# Altium project vib_analysis_hub.PrjPcb
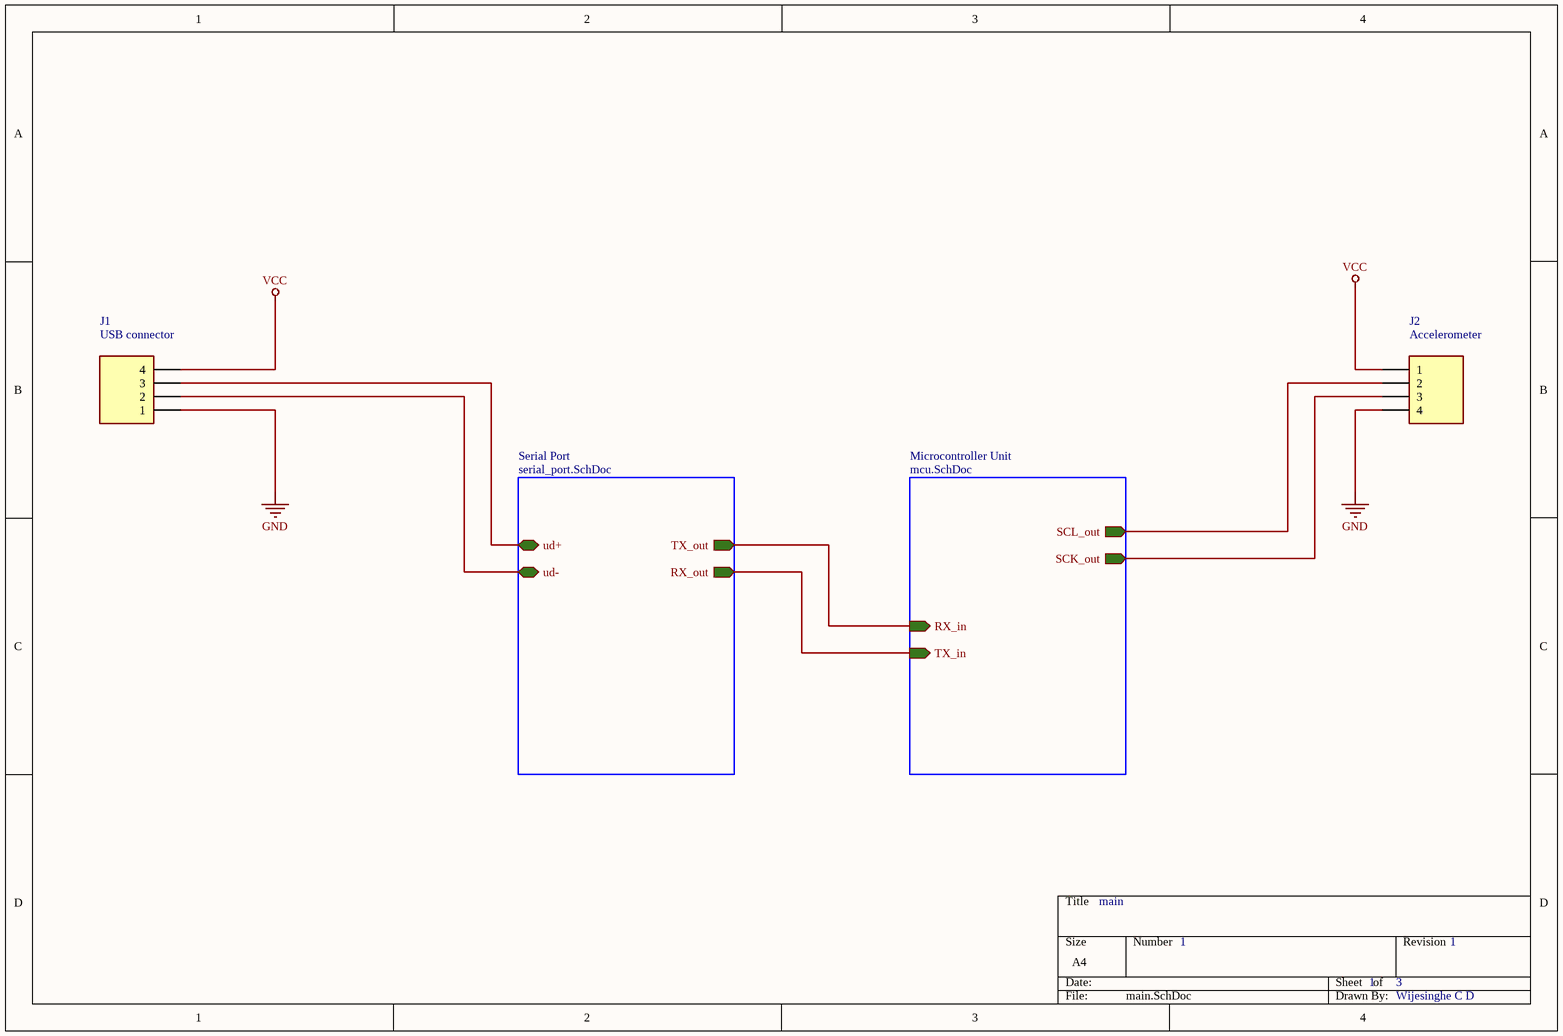
[diagram p0: main.SchDoc]
3 sheets, 16 parts. Net scope: hierarchical (ports join the sheet entries above them; power ports are global).
Board file: pcb_main.PcbDoc
Sheets:
  main.SchDoc
    Microcontroller Unit = mcu.SchDoc
    Serial Port = serial_port.SchDoc

## Sheet main.SchDoc
size A4; SheetNumber: 1; SheetTotal: 3

### Parts
J1  USB connector  [B04BPSILEA1LFSN]
J2  Accelerometer  [B04BPSILEA1LFSN]

### Sub-sheets
Microcontroller Unit = mcu.SchDoc: RX_in (in), TX_in (in), SCL_out (out), SCK_out (out)
Serial Port = serial_port.SchDoc: RX_out (out), TX_out (out), ud+ (bidir), ud- (bidir)

### Nets
GND: J1.1 J2.4
VCC: J1.4 J2.1
NetJ1_2: J1.2 ; sheet Serial Port/ud-
NetJ1_3: J1.3 ; sheet Serial Port/ud+
NetJ2_2: J2.2 ; sheet Microcontroller Unit/SCL_out
NetJ2_3: J2.3 ; sheet Microcontroller Unit/SCK_out
NetU1_30: sheet Microcontroller Unit/RX_in, sheet Serial Port/TX_out
NetU1_31: sheet Microcontroller Unit/TX_in, sheet Serial Port/RX_out

### Notes on the sheet
- main
- 1
- 3
- Wijesinghe C D

### Library data of the parts
J1 J2 = B04B-PSILE-A1_LF__SN_: Connector; Manufacturer_Name: JST (JAPAN SOLDERLESS TERMINALS); Manufacturer_Part_Number: B04B-PSILE-A1(LF)(SN); Datasheet Link: http://uk.rs-online.com/web/p/products/1383547; Height: 12.35mm

## Sheet mcu.SchDoc
size A4; ApprovedBy: wijesinghecd; DrawnBy: wijesinghecd; SheetNumber: 2; SheetTotal: 3
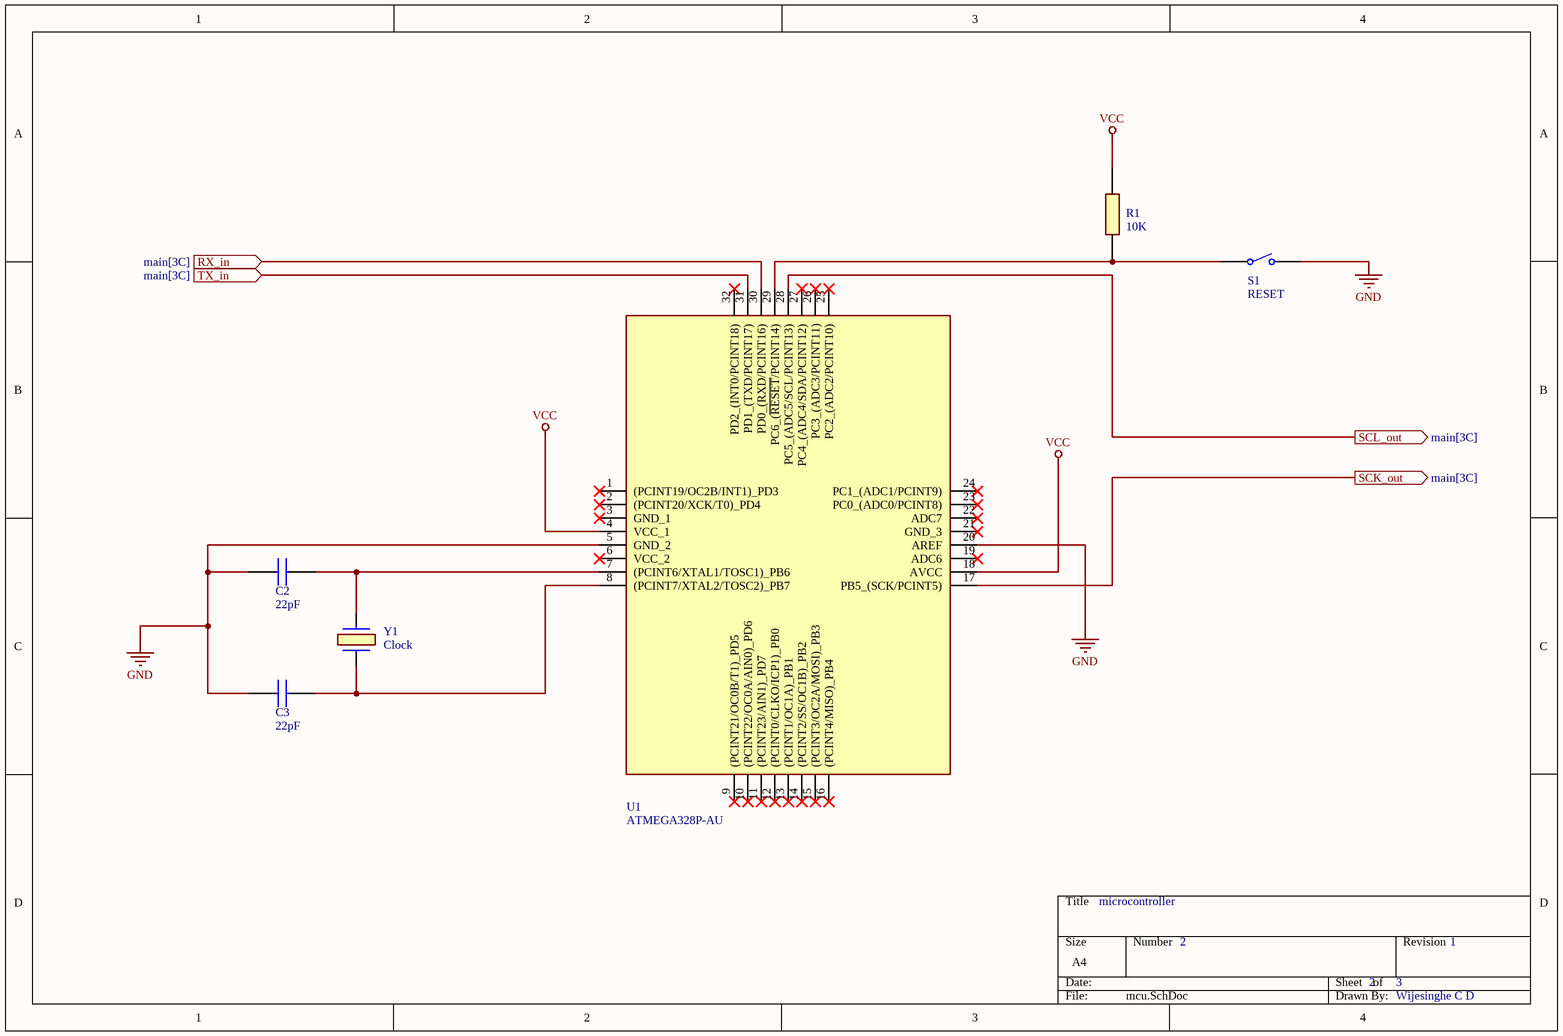
[diagram p1: mcu.SchDoc]

### Parts
C2  22pF  [CAPC3216X100N]
C3  22pF  [CAPC3216X100N]
R1  10K  [RESC2012X75N]
S1  RESET  [TECO-FSMSM-2_V]
U1  ATMEGA328P-AU  [QFP80P900X900X120-32N]
Y1  Clock  [ECS160203XTR]

### Ports
RX_in (in, see main[3C]), SCK_out (out, see main[3C]), SCL_out (out, see main[3C]), TX_in (in, see main[3C])

### Nets
GND: C2.1 C3.1 S1.2 U1.5(GND_2) U1.20(AREF)
VCC: R1.2 U1.4(VCC_1) U1.18(AVCC)
NetC2_2: C2.2 U1.7((PCINT6/XTAL1/TOSC1)_PB6) Y1.1(X1)
NetC3_2: C3.2 U1.8((PCINT7/XTAL2/TOSC2)_PB7) Y1.2(X2)
NetJ2_2: U1.28(PC5_(ADC5/SCL/PCINT13)) ; port SCL_out
NetJ2_3: U1.17(PB5_(SCK/PCINT5)) ; port SCK_out
NetR1_1: R1.1 S1.1 U1.29(PC6_(~{RESET}/PCINT14))
NetU1_30: U1.30(PD0_(RXD/PCINT16)) ; port RX_in
NetU1_31: U1.31(PD1_(TXD/PCINT17)) ; port TX_in

Not connected (* = marked no-connect by the designer): U1 1((PCINT19/OC2B/INT1)_PD3)* 2((PCINT20/XCK/T0)_PD4)* 3(GND_1)* 6(VCC_2)* 9((PCINT21/OC0B/T1)_PD5)* 10((PCINT22/OC0A/AIN0)_PD6)* 11((PCINT23/AIN1)_PD7)* 12((PCINT0/CLKO/ICP1)_PB0)* 13((PCINT1/OC1A)_PB1)* 14((PCINT2/SS/OC1B)_PB2)* 15((PCINT3/OC2A/MOSI)_PB3)* 16((PCINT4/MISO)_PB4)* 19(ADC6)* 21(GND_3)* 22(ADC7)* 23(PC0_(ADC0/PCINT8))* 24(PC1_(ADC1/PCINT9))* 25(PC2_(ADC2/PCINT10))* 26(PC3_(ADC3/PCINT11))* 27(PC4_(ADC4/SDA/PCINT12))* 32(PD2_(INT0/PCINT18))*

### Notes on the sheet
- microcontroller
- 2
- 3
- 1
- Wijesinghe C D

### Library data of the parts
C2 C3 = CL31C220JBCNNNC: Capacitor; Manufacturer_Name: SAMSUNG; Datasheet Link: http://product.samsungsem.com/mlcc/CL31C220JBCNNN.do; Height: 1mm; Manufacturer_Part_Number: CL31C220JBCNNNC; Mouser Part Number: 187-CL31C220JBCNNNC; Mouser Price/Stock: https://www.mouser.co.uk/ProductDetail/Samsung-Electro-Mechanics/CL31C220JBCNNNC?qs=349EhDEZ59op%2FLhphPFLcA%3D%3D; Arrow Part Number: CL31C220JBCNNNC; Arrow Price/Stock: https://www.arrow.com/en/products/cl31c220jbcnnnc/samsung-electro-mechanics?region=nac
R1 = ERJ-P6WF1002V: Resistor; Manufacturer_Name: Panasonic; Datasheet Link: https://datasheet.datasheetarchive.com/originals/distributors/DKDS-25/487413.pdf; Height: 0.75mm; Manufacturer_Part_Number: ERJ-P6WF1002V; Mouser Part Number: 667-ERJ-P6WF1002V; Mouser Price/Stock: https://www.mouser.co.uk/ProductDetail/Panasonic/ERJ-P6WF1002V?qs=%252B9%2Fcbd0IE0SZfBV6iDIV5A%3D%3D; Arrow Part Number: ERJ-P6WF1002V; Arrow Price/Stock: https://www.arrow.com/en/products/erj-p6wf1002v/panasonic?region=nac
S1 = CMP-2000-07511-1: FSMSM Push Button Switch, 50 mA, -35 to 85 degC, 2-Pin SMD, RoHS, Bulk; Manufacturer: TE Connectivity; Actuator Length: 1.07mm; Electrical Life: 20000Cycles; Actuator Material: Polyamide; Current Rating: 50mA; Illumination Type: Illuminated; Voltage Rating (DC): 24V; Contact Resistance: 100mOhm; Case\/Package: SMD/SMT; Operating Force: 180gf; Switch Travel: 0.25mm; Max Voltage Rating (DC): 12V; Throw Configuration: SPST; Packaging: LoosePiece; Max Operating Temperature: 85degC; ELV: Compliant; Package Description: 2-Pin Surface Mount Device, Body 6 x 3.5 mm, Pitch 9.19 mm; RoHSCompliant: true; Manufacturer URL: http://www.te.com/; Contact Plating: Silver; Contact Material: Brass; Mounting Technology: SurfaceMount; Contact Current Rating: 50mA; Datasheet Version: Rev. C2, 08/2014; Datasheet URL: http://www.te.com/commerce/DocumentDelivery/DDEController?Action=showdoc&DocId=Customer+Drawing%7F1437566-3%7FC2%7Fpdf%7FEnglish%7FENG_CD_1437566-3_C2_1437566_3_1_c.dwg.pdf%7F1437566-3; Mechanical Life: 20000Cycles; Package Reference: FSMSM; REACH SVHC: Unknown; Orientation: Straight; Min Operating Temperature: -35degC; Lead Free: LeadFree; Termination: GullWing; Package Quantity: 1000; Mount: SurfaceMount
U1 = ATMEGA328P-AU: Integrated Circuit; Manufacturer_Name: Microchip; Datasheet Link: https://componentsearchengine.com/Datasheets/2/ATMEGA328P-AU.pdf; Height: 1.2mm; Manufacturer_Part_Number: ATMEGA328P-AU; Mouser Part Number: 556-ATMEGA328P-AU; Mouser Price/Stock: https://www.mouser.co.uk/ProductDetail/Microchip-Technology/ATMEGA328P-AU?qs=K8BHR703ZXiCmmgp6%2FGNmQ%3D%3D; Arrow Part Number: ATMEGA328P-AU; Arrow Price/Stock: https://www.arrow.com/en/products/atmega328p-au/microchip-technology?region=europe
Y1 = ECS-160-20-3X-TR: Crystal or Oscillator; Manufacturer_Name: ECS; Datasheet Link: https://www.arrow.com/en/products/ecs-160-20-3x-tr/ecs-international; Height: 2.3mm; Manufacturer_Part_Number: ECS-160-20-3X-TR; Mouser Part Number: 520-160-20-3XT; Mouser Price/Stock: https://www.mouser.co.uk/ProductDetail/ECS/ECS-160-20-3X-TR?qs=7Z%2FjUg96RbU1ElbRFXn8Rw%3D%3D; Arrow Part Number: ECS-160-20-3X-TR; Arrow Price/Stock: https://www.arrow.com/en/products/ecs-160-20-3x-tr/ecs-international?region=nac

## Sheet serial_port.SchDoc
size A4; SheetNumber: 3; SheetTotal: 3
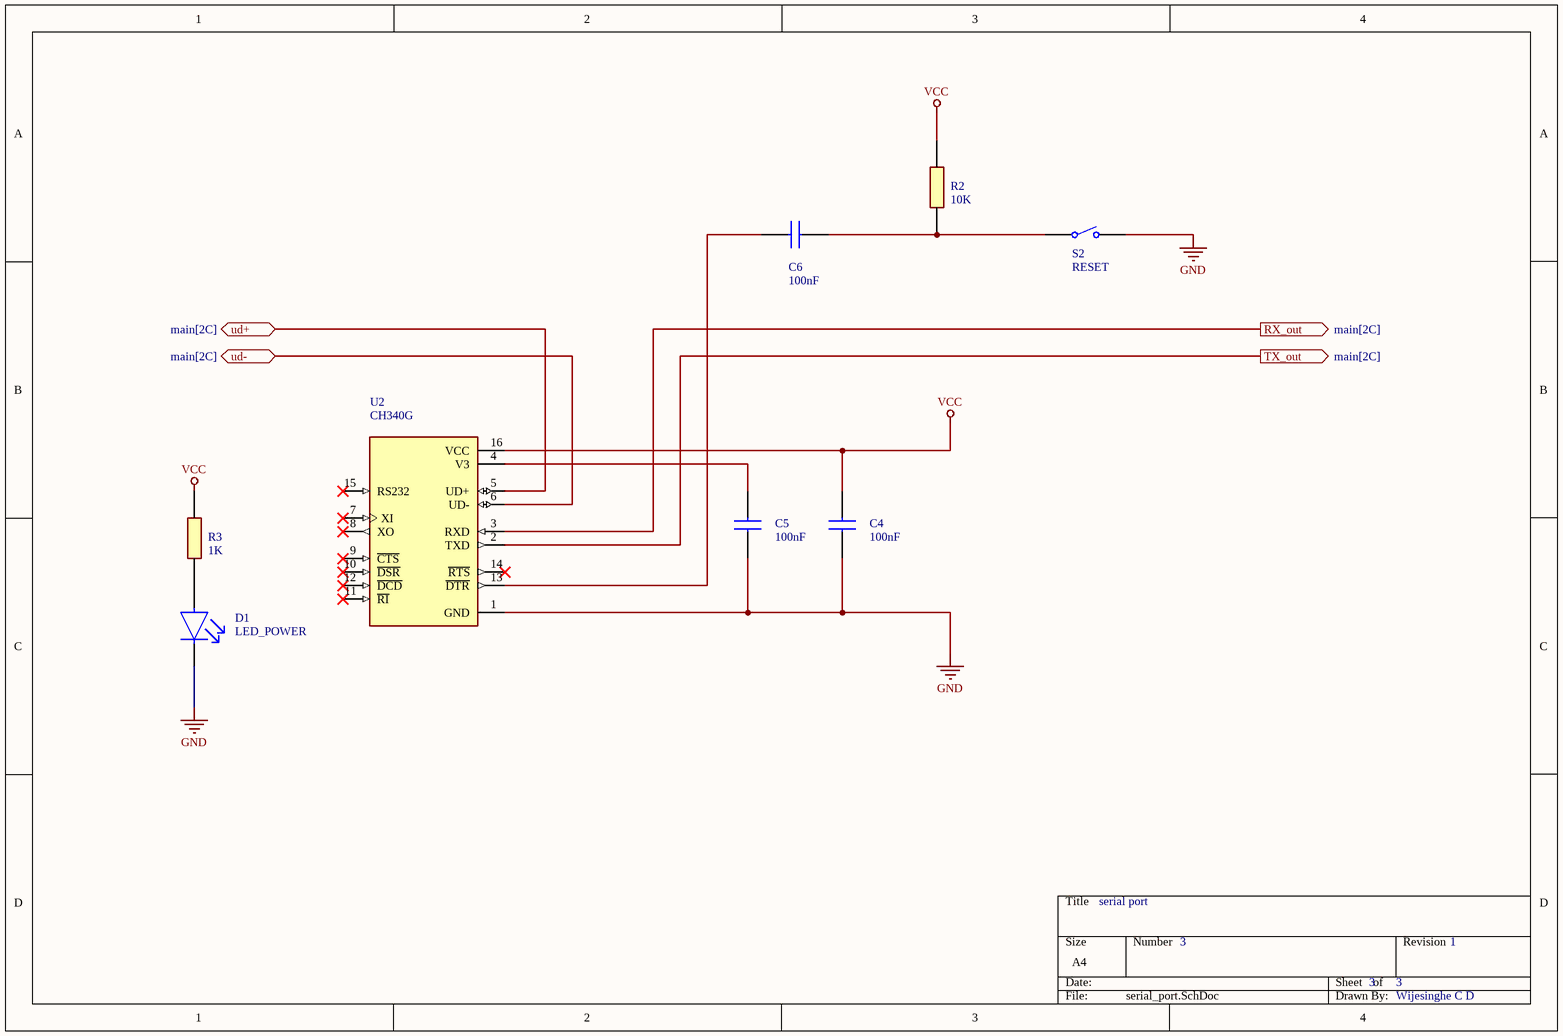
[diagram p2: serial_port.SchDoc]

### Parts
C4  100nF  [CAPC1608X90N]
C5  100nF  [CAPC1608X90N]
C6  100nF  [CAPC1608X90N]
D1  LED_POWER  [FP-LTST-C190GKT-MFG]
R2  10K  [RESC2012X75N]
R3  1K  [RESC2012X75N]
S2  RESET  [TECO-FSMSM-2_V]
U2  CH340G  [SOIC127P600X180-16N]

### Ports
RX_out (out, see main[2C]), TX_out (out, see main[2C]), ud+ (bidir, see main[2C]), ud- (bidir, see main[2C])

### Nets
GND: C4.2 C5.2 D1.1(C) S2.2 U2.1(GND)
VCC: C4.1 R2.2 R3.2 U2.16(VCC)
NetC5_1: C5.1 U2.4(V3)
NetC6_1: C6.1 U2.13(~{DTR})
NetC6_2: C6.2 R2.1 S2.1
NetD1_2: D1.2(A) R3.1
NetJ1_2: U2.6(UD-) ; port ud-
NetJ1_3: U2.5(UD+) ; port ud+
NetU1_30: U2.2(TXD) ; port TX_out
NetU1_31: U2.3(RXD) ; port RX_out

Not connected (* = marked no-connect by the designer): U2 7(XI)* 8(XO)* 9(~{CTS})* 10(~{DSR})* 11(~{RI})* 12(~{DCD})* 14(~{RTS})* 15(RS232)*

### Notes on the sheet
- serial port
- 3
- 1
- Wijesinghe C D

### Library data of the parts
C4-C6 = CL10B104JB8NNNC: Capacitor; Manufacturer_Name: SAMSUNG; Datasheet Link: https://datasheet.datasheetarchive.com/originals/distributors/Datasheets_SAMA/dd149ce8a6679b37799cedb31427d43d.pdf; Height: 0.9mm; Manufacturer_Part_Number: CL10B104JB8NNNC; Mouser Part Number: 187-CL10B104JB8NNNC; Mouser Price/Stock: https://www.mouser.co.uk/ProductDetail/Samsung-Electro-Mechanics/CL10B104JB8NNNC?qs=349EhDEZ59oLEw5wc1qvGw%3D%3D; Arrow Part Number: CL10B104JB8NNNC; Arrow Price/Stock: https://www.arrow.com/en/products/cl10b104jb8nnnc/samsung-electro-mechanics?region=nac
D1 = CMP-22017-000005-2: LED GREEN CLEAR CHIP SMD; Dominant Wavelength: 569nm; Reverse Voltage: 5V; Lens Color: Colorless; Viewing Angle: 130°; Voltage: 2V; Forward Current: 30mA; Power Dissipation: 100mW; Luminous Intensity: 6mcd; Number of LEDs: 1; Forward Voltage: 2.1V; Wavelength: 565nm; Test Current: 10mA; Min Operating Temperature: -55°C; Lens Style: Clear; Mount: Surface Mount; Width: 0.8mm; Packaging: Tape and Reel; Lens Transparency: Clear; Case Code (Metric): 1608; Depth: 0.8mm; Case Code (Imperial): 0603; Case/Package: 0603; Number of Pins: 2; Max Operating Temperature: 85°C; Lead Free: Lead Free; Number of Elements: 1; Length: 1.6mm; Height: 0.8mm; Package Quantity: 1; Power Rating: 100mW; Radiation Hardening: No; Illumination Color: Green; Color: Green
R2 R3 = ERJ-P6WF1002V: Resistor; Manufacturer_Name: Panasonic; Datasheet Link: https://datasheet.datasheetarchive.com/originals/distributors/DKDS-25/487413.pdf; Height: 0.75mm; Manufacturer_Part_Number: ERJ-P6WF1002V; Mouser Part Number: 667-ERJ-P6WF1002V; Mouser Price/Stock: https://www.mouser.co.uk/ProductDetail/Panasonic/ERJ-P6WF1002V?qs=%252B9%2Fcbd0IE0SZfBV6iDIV5A%3D%3D; Arrow Part Number: ERJ-P6WF1002V; Arrow Price/Stock: https://www.arrow.com/en/products/erj-p6wf1002v/panasonic?region=nac
S2 = CMP-2000-07511-1: as S1 on sheet mcu; Packaging: LoosePiece; Max Operating Temperature: 85degC; ELV: Compliant; Package Description: 2-Pin Surface Mount Device, Body 6 x 3.5 mm, Pitch 9.19 mm; RoHSCompliant: true; Manufacturer URL: http://www.te.com/; Contact Plating: Silver; Contact Material: Brass; Mounting Technology: SurfaceMount; Contact Current Rating: 50mA; Datasheet Version: Rev. C2, 08/2014; Datasheet URL: http://www.te.com/commerce/DocumentDelivery/DDEController?Action=showdoc&DocId=Customer+Drawing%7F1437566-3%7FC2%7Fpdf%7FEnglish%7FENG_CD_1437566-3_C2_1437566_3_1_c.dwg.pdf%7F1437566-3; Mechanical Life: 20000Cycles; Package Reference: FSMSM; REACH SVHC: Unknown; Orientation: Straight; Min Operating Temperature: -35degC; Lead Free: LeadFree; Termination: GullWing; Package Quantity: 1000; Mount: SurfaceMount
U2 = CH340G: USB Interface Integrated Circuit; MF: WCH; Value: *; SnapEDA_Link: https://www.snapeda.com/parts/Ch340G/WCH/view-part/?ref=snap; MP: Ch340G; Check_prices: https://www.snapeda.com/parts/Ch340G/WCH/view-part/?ref=eda; Availability: Not in stock; Price: None; Package: None

## Nets that join several sheets
GND: main (J1.1 J2.4), mcu (5 pins), serial_port (5 pins)
VCC: main (J1.4 J2.1), mcu (R1.2 U1.4 U1.18), serial_port (C4.1 R2.2 R3.2 U2.16)
NetJ1_2: main (J1.2), serial_port (U2.6)
NetJ1_3: main (J1.3), serial_port (U2.5)
NetJ2_2: main (J2.2), mcu (U1.28)
NetJ2_3: main (J2.3), mcu (U1.17)
NetU1_30: mcu (U1.30), serial_port (U2.2)
NetU1_31: mcu (U1.31), serial_port (U2.3)